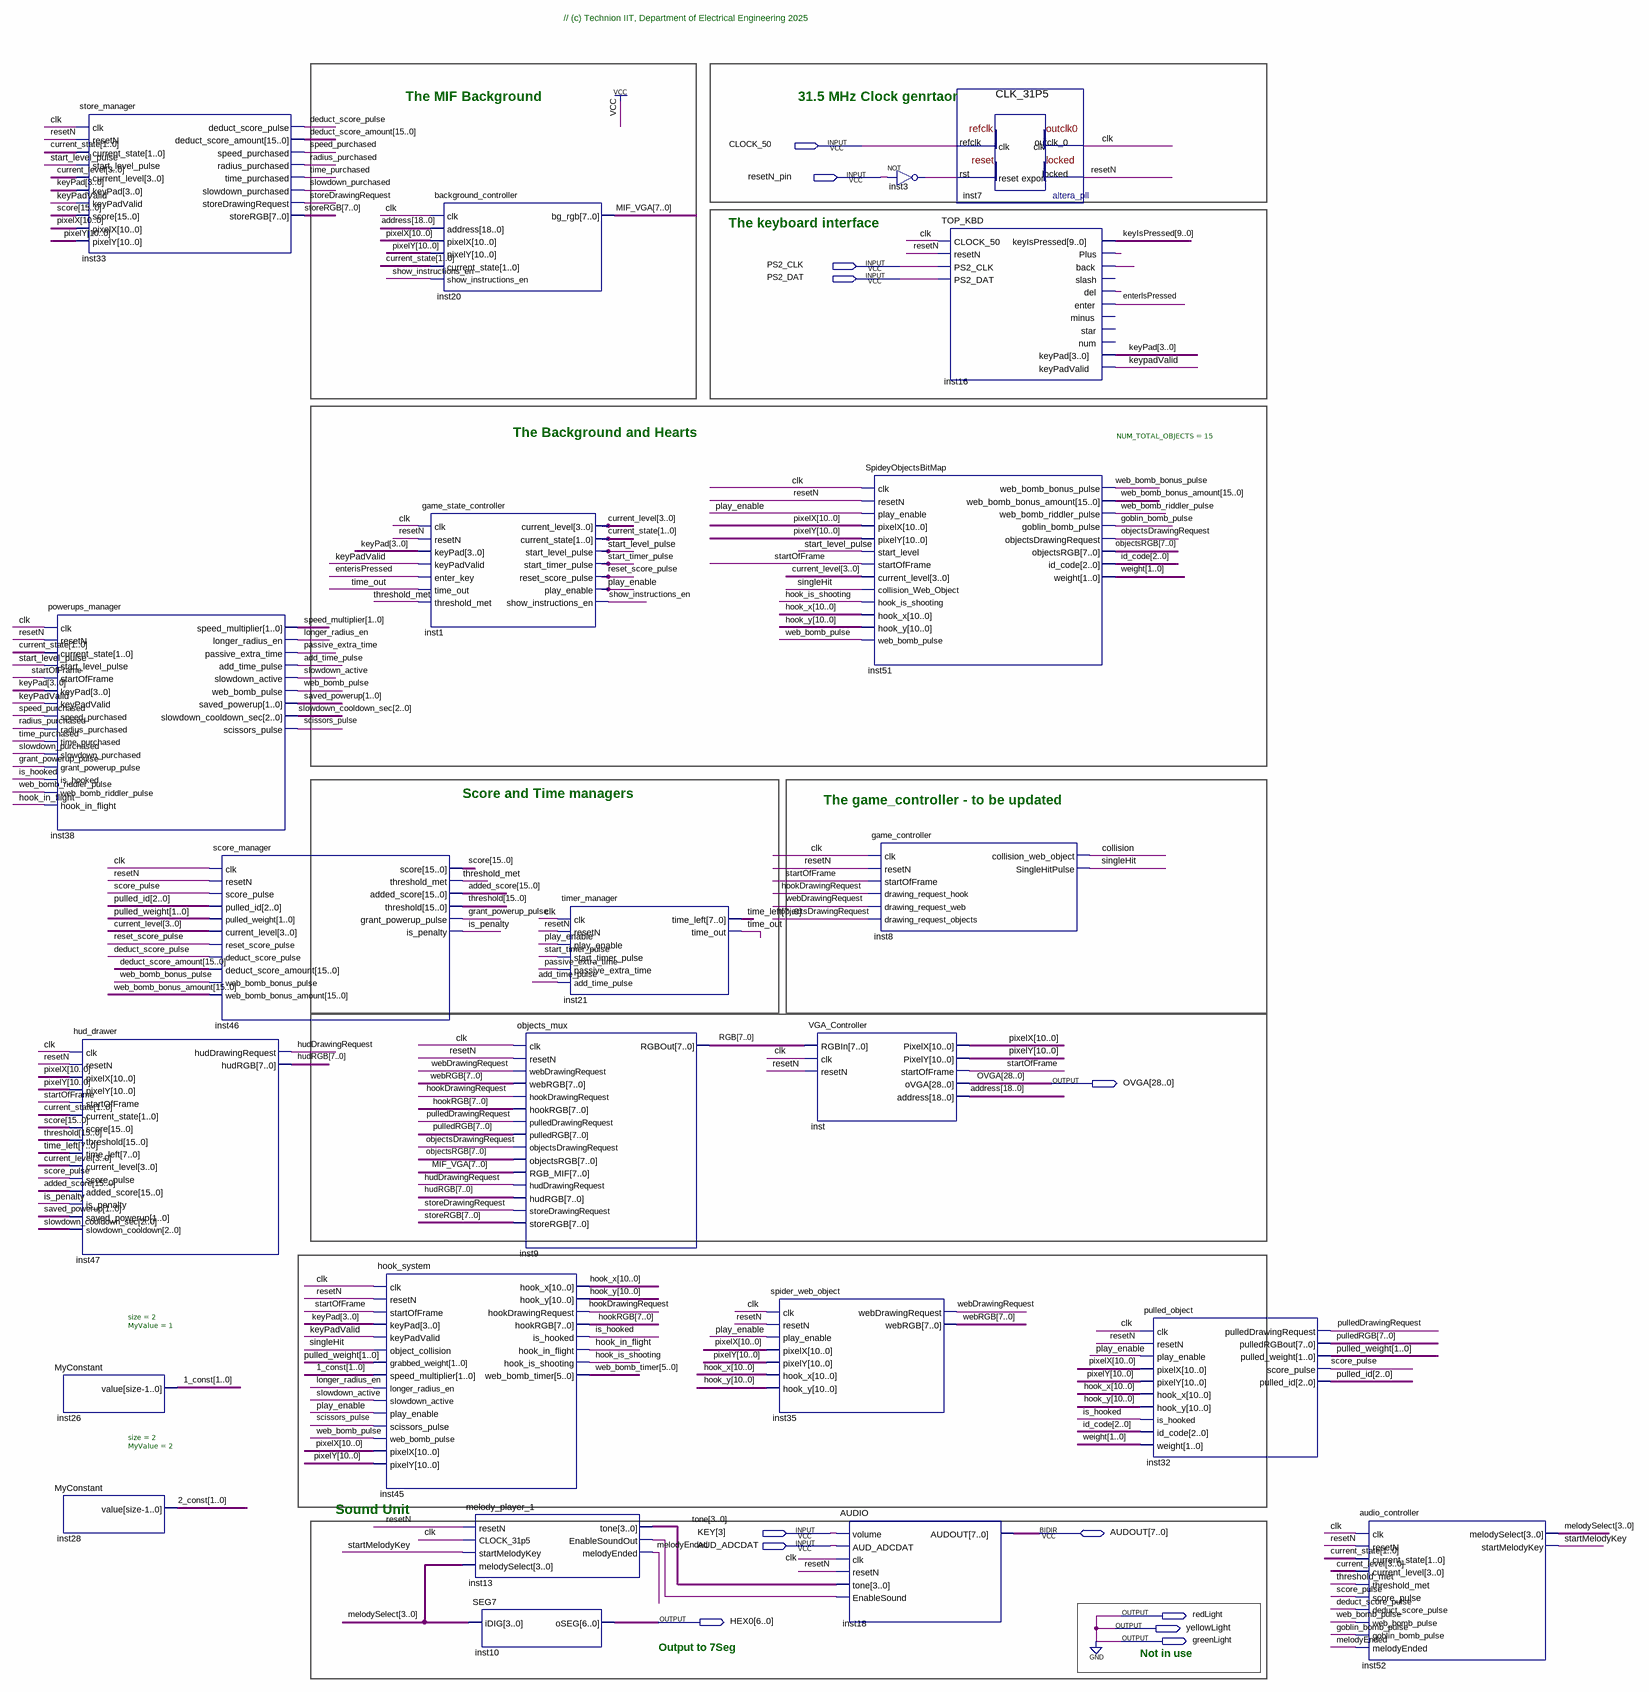
[diagram p0: schematic sheet]
// Quartus schematic TOP_VGA_DEMO_KBD.bdf as structural Verilog: 23 symbols, 12 pins
module TOP_VGA_DEMO_KBD (
  input  CLOCK_50,
  input  resetN_pin,
  input  PS2_CLK,
  input  PS2_DAT,
  input  [3:3] KEY,
  input  AUD_ADCDAT,
  inout  [7:0] AUDOUT,
  output [28:0] OVGA,
  output redLight,
  output [6:0] HEX0,
  output yellowLight,
  output greenLight
);

  wire add_time_pulse, clk, collision, deduct_score_pulse, enterIsPressed, goblin_bomb_pulse,
       grant_powerup_pulse, hook_in_flight, hook_is_shooting, hookDrawingRequest, hudDrawingRequest,
       inst3_out, inst13_enablesoundout, inst16_back, inst16_del, inst16_plus, is_hooked, is_penalty,
       keypadValid, longer_radius_en, melodyEnded, objectsDrawingRequest, passive_extra_time, play_enable,
       pulledDrawingRequest, radius_purchased, reset_score_pulse, resetN, scissors_pulse, score_pulse,
       show_instructions_en, singleHit, slowdown_active, slowdown_purchased, speed_purchased,
       start_level_pulse, start_timer_pulse, startMelodyKey, startOfFrame, storeDrawingRequest,
       threshold_met, time_out, time_purchased, web_bomb_bonus_pulse, web_bomb_pulse, web_bomb_riddler_pulse,
       webDrawingRequest;
  wire [1:0] \1_const , \2_const , current_state, pulled_weight, saved_powerup, speed_multiplier, weight;
  wire [2:0] id_code, pulled_id, slowdown_cooldown_sec;
  wire [3:0] current_level, keyPad, melodySelect, tone;
  wire [5:0] web_bomb_timer;
  wire [7:0] hookRGB, hudRGB, MIF_VGA, objectsRGB, pulledRGB, RGB, storeRGB, time_left, webRGB;
  wire [9:0] keyIsPressed;
  wire [10:0] hook_x, hook_y, pixelX, pixelY;
  wire [15:0] added_score, deduct_score_amount, score, threshold, web_bomb_bonus_amount;
  wire [18:0] address;

  store_manager inst33 (
    .clk(clk), .resetN(resetN), .current_state(current_state), .start_level_pulse(start_level_pulse),
    .current_level(current_level), .keyPad(keyPad), .keyPadValid(keypadValid), .score(score),
    .pixelX(pixelX), .pixelY(pixelY), .deduct_score_pulse(deduct_score_pulse),
    .deduct_score_amount(deduct_score_amount), .speed_purchased(speed_purchased),
    .radius_purchased(radius_purchased), .time_purchased(time_purchased),
    .slowdown_purchased(slowdown_purchased), .storeDrawingRequest(storeDrawingRequest), .storeRGB(storeRGB));
  powerups_manager inst38 (
    .clk(clk), .resetN(resetN), .current_state(current_state), .start_level_pulse(start_level_pulse),
    .startOfFrame(startOfFrame), .keyPad(keyPad), .keyPadValid(keypadValid),
    .speed_purchased(speed_purchased), .radius_purchased(radius_purchased), .time_purchased(time_purchased),
    .slowdown_purchased(slowdown_purchased), .grant_powerup_pulse(grant_powerup_pulse),
    .is_hooked(is_hooked), .web_bomb_riddler_pulse(web_bomb_riddler_pulse), .hook_in_flight(hook_in_flight),
    .speed_multiplier(speed_multiplier), .longer_radius_en(longer_radius_en),
    .passive_extra_time(passive_extra_time), .add_time_pulse(add_time_pulse),
    .slowdown_active(slowdown_active), .web_bomb_pulse(web_bomb_pulse), .saved_powerup(saved_powerup),
    .slowdown_cooldown_sec(slowdown_cooldown_sec), .scissors_pulse(scissors_pulse));
  hud_drawer inst47 (
    .clk(clk), .resetN(resetN), .pixelX(pixelX), .pixelY(pixelY), .startOfFrame(startOfFrame),
    .current_state(current_state), .score(score), .threshold(threshold), .time_left(time_left),
    .current_level(current_level), .score_pulse(score_pulse), .added_score(added_score),
    .is_penalty(is_penalty), .saved_powerup(saved_powerup), .slowdown_cooldown(slowdown_cooldown_sec),
    .hudDrawingRequest(hudDrawingRequest), .hudRGB(hudRGB));
  MyConstant #(.size(2), .MyValue(1)) inst26 (.value(\1_const ));
  MyConstant #(.size(2), .MyValue(2)) inst28 (.value(\2_const ));
  score_manager inst46 (
    .clk(clk), .resetN(resetN), .score_pulse(score_pulse), .pulled_id(pulled_id),
    .pulled_weight(pulled_weight), .current_level(current_level), .reset_score_pulse(reset_score_pulse),
    .deduct_score_pulse(deduct_score_pulse), .deduct_score_amount(deduct_score_amount),
    .web_bomb_bonus_pulse(web_bomb_bonus_pulse), .web_bomb_bonus_amount(web_bomb_bonus_amount),
    .score(score), .threshold_met(threshold_met), .added_score(added_score), .threshold(threshold),
    .grant_powerup_pulse(grant_powerup_pulse), .is_penalty(is_penalty));
  hook_system inst45 (
    .clk(clk), .resetN(resetN), .startOfFrame(startOfFrame), .keyPad(keyPad), .keyPadValid(keypadValid),
    .object_collision(singleHit), .grabbed_weight(pulled_weight), .speed_multiplier(\1_const ),
    .longer_radius_en(longer_radius_en), .slowdown_active(slowdown_active), .play_enable(play_enable),
    .scissors_pulse(scissors_pulse), .web_bomb_pulse(web_bomb_pulse), .pixelX(pixelX), .pixelY(pixelY),
    .hook_x(hook_x), .hook_y(hook_y), .hookDrawingRequest(hookDrawingRequest), .hookRGB(hookRGB),
    .is_hooked(is_hooked), .hook_in_flight(hook_in_flight), .hook_is_shooting(hook_is_shooting),
    .web_bomb_timer(web_bomb_timer));
  background_controller inst20 (
    .clk(clk), .address(address), .pixelX(pixelX), .pixelY(pixelY), .current_state(current_state),
    .show_instructions_en(show_instructions_en), .bg_rgb(MIF_VGA));
  game_state_controller inst1 (
    .clk(clk), .resetN(resetN), .keyPad(keyPad), .keyPadValid(keypadValid), .enter_key(enterIsPressed),
    .time_out(time_out), .threshold_met(threshold_met), .current_level(current_level),
    .current_state(current_state), .start_level_pulse(start_level_pulse),
    .start_timer_pulse(start_timer_pulse), .reset_score_pulse(reset_score_pulse), .play_enable(play_enable),
    .show_instructions_en(show_instructions_en));
  melody_player_1 inst13 (
    .resetN(resetN), .CLOCK_31p5(clk), .startMelodyKey(startMelodyKey), .melodySelect(melodySelect),
    .tone(tone), .EnableSoundOut(inst13_enablesoundout), .melodyEnded(melodyEnded));
  SEG7 inst10 (.iDIG(melodySelect), .oSEG(HEX0));
  objects_mux inst9 (
    .clk(clk), .resetN(resetN), .webDrawingRequest(webDrawingRequest), .webRGB(webRGB),
    .hookDrawingRequest(hookDrawingRequest), .hookRGB(hookRGB), .pulledDrawingRequest(pulledDrawingRequest),
    .pulledRGB(pulledRGB), .objectsDrawingRequest(objectsDrawingRequest), .objectsRGB(objectsRGB),
    .RGB_MIF(MIF_VGA), .hudDrawingRequest(hudDrawingRequest), .hudRGB(hudRGB),
    .storeDrawingRequest(storeDrawingRequest), .storeRGB(storeRGB), .RGBOut(RGB));
  timer_manager inst21 (
    .clk(clk), .resetN(resetN), .play_enable(play_enable), .start_timer_pulse(start_timer_pulse),
    .passive_extra_time(passive_extra_time), .add_time_pulse(add_time_pulse), .time_left(time_left),
    .time_out(time_out));
  spider_web_object inst35 (
    .clk(clk), .resetN(resetN), .play_enable(play_enable), .pixelX(pixelX), .pixelY(pixelY), .hook_x(hook_x),
    .hook_y(hook_y), .webDrawingRequest(webDrawingRequest), .webRGB(webRGB));
  VGA_Controller inst (
    .RGBIn(RGB), .clk(clk), .resetN(resetN), .PixelX(pixelX), .PixelY(pixelY), .startOfFrame(startOfFrame),
    .oVGA(OVGA), .address(address));
  AUDIO inst18 (
    .volume(KEY[3]), .AUD_ADCDAT(AUD_ADCDAT), .clk(clk), .resetN(resetN), .tone(tone),
    .EnableSound(inst13_enablesoundout), .AUDOUT(AUDOUT));
  not inst3 (inst3_out, resetN_pin);
  SpideyObjectsBitMap #(.NUM_TOTAL_OBJECTS(15)) inst51 (
    .clk(clk), .resetN(resetN), .play_enable(play_enable), .pixelX(pixelX), .pixelY(pixelY),
    .start_level(start_level_pulse), .startOfFrame(startOfFrame), .current_level(current_level),
    .collision_Web_Object(singleHit), .hook_is_shooting(hook_is_shooting), .hook_x(hook_x), .hook_y(hook_y),
    .web_bomb_pulse(web_bomb_pulse), .web_bomb_bonus_pulse(web_bomb_bonus_pulse),
    .web_bomb_bonus_amount(web_bomb_bonus_amount), .web_bomb_riddler_pulse(web_bomb_riddler_pulse),
    .goblin_bomb_pulse(goblin_bomb_pulse), .objectsDrawingRequest(objectsDrawingRequest),
    .objectsRGB(objectsRGB), .id_code(id_code), .weight(weight));
  game_controller inst8 (
    .clk(clk), .resetN(resetN), .startOfFrame(startOfFrame), .drawing_request_hook(hookDrawingRequest),
    .drawing_request_web(webDrawingRequest), .drawing_request_objects(objectsDrawingRequest),
    .collision_web_object(collision), .SingleHitPulse(singleHit));
  TOP_KBD inst16 (
    .CLOCK_50(clk), .resetN(resetN), .PS2_CLK(PS2_CLK), .PS2_DAT(PS2_DAT), .keyIsPressed(keyIsPressed),
    .Plus(inst16_plus), .back(inst16_back), .del(inst16_del), .enter(enterIsPressed), .keyPad(keyPad),
    .keyPadValid(keypadValid));  // open: slash, minus, star, num
  CLK_31P5 inst7 (.refclk(CLOCK_50), .rst(inst3_out), .outclk_0(clk), .locked(resetN));
  pulled_object inst32 (
    .clk(clk), .resetN(resetN), .play_enable(play_enable), .pixelX(pixelX), .pixelY(pixelY), .hook_x(hook_x),
    .hook_y(hook_y), .is_hooked(is_hooked), .id_code(id_code), .weight(weight),
    .pulledDrawingRequest(pulledDrawingRequest), .pulledRGBout(pulledRGB), .pulled_weight(pulled_weight),
    .score_pulse(score_pulse), .pulled_id(pulled_id));
  audio_controller inst52 (
    .clk(clk), .resetN(resetN), .current_state(current_state), .current_level(current_level),
    .threshold_met(threshold_met), .score_pulse(score_pulse), .deduct_score_pulse(deduct_score_pulse),
    .web_bomb_pulse(web_bomb_pulse), .goblin_bomb_pulse(goblin_bomb_pulse), .melodyEnded(melodyEnded),
    .melodySelect(melodySelect), .startMelodyKey(startMelodyKey));

  assign greenLight = 1'b0;
  assign redLight = 1'b0;
  assign yellowLight = 1'b0;

  // Notes on the sheet:
  //   // (c) Technion IIT, Department of Electrical Engineering 2025
  //   The MIF Background
  //   31.5 MHz Clock genrtaor
  //   The keyboard interface
  //   The Background and Hearts
  //   Score and Time managers
  //   The game_controller - to be updated
  //   Sound Unit
  //   Output to 7Seg
  //   Not in use
endmodule
